# Altium schematic sheet receiver-d.SchDoc: MW Bench - Receiver
size A3; Organization: Altium Limited; Address1: L3, 12a Rodborough Rd; Address2: Frenchs Forest; Address3: NSW; Address4: Australia 2086; SheetNumber: 2; SheetTotal: 2
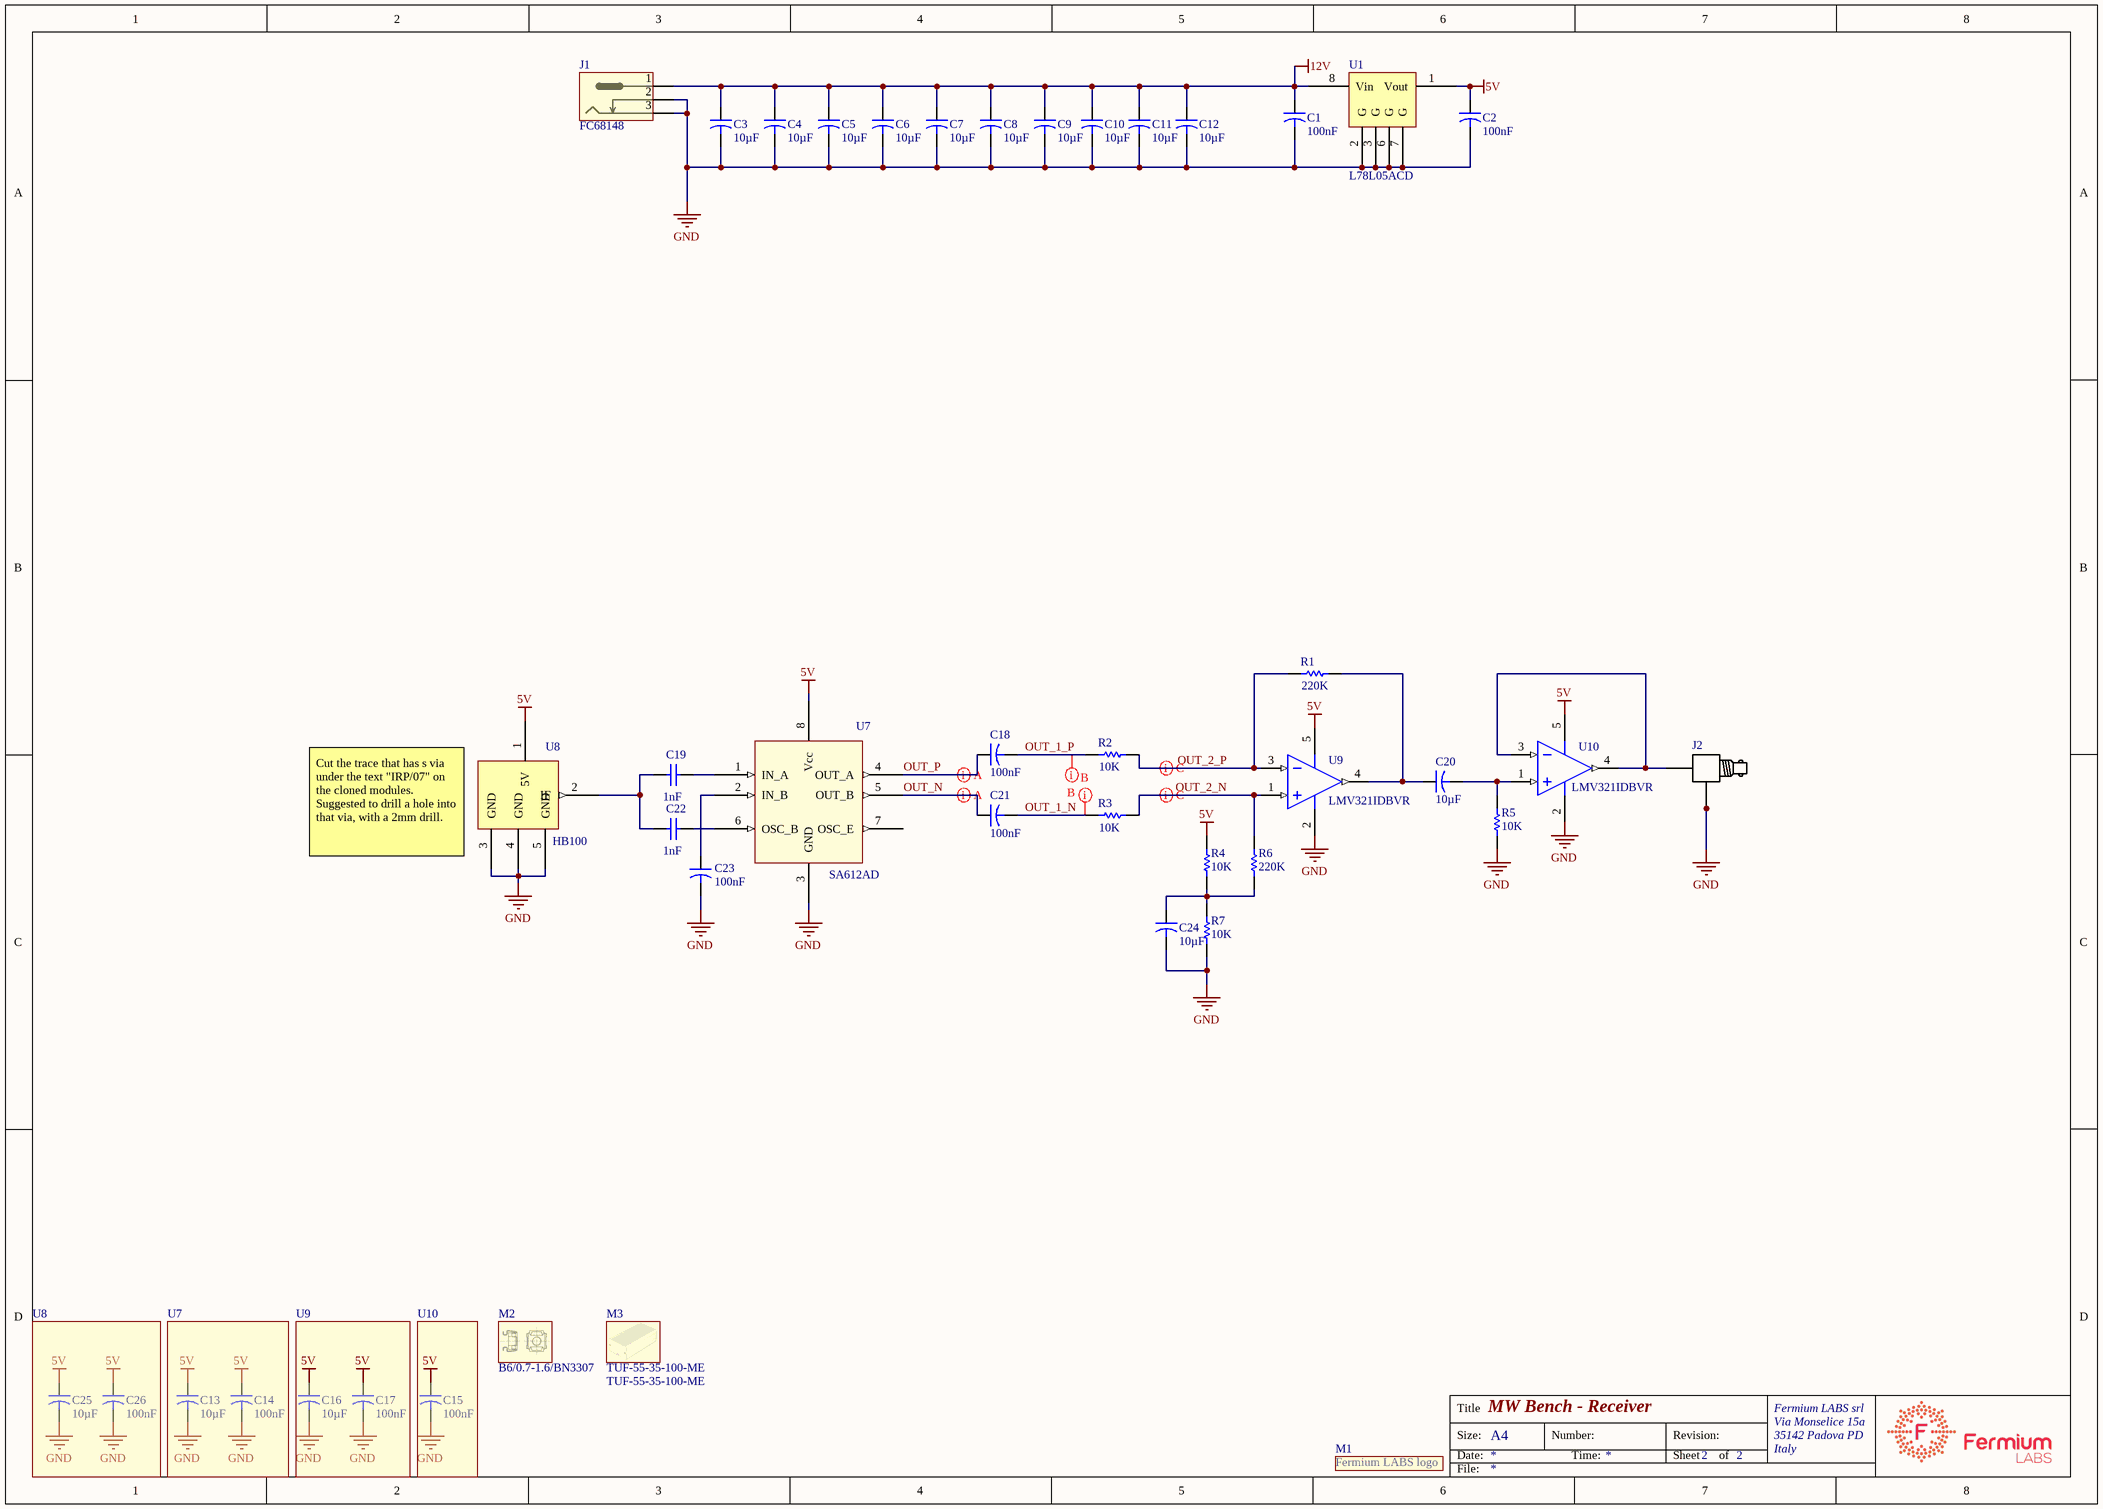
[diagram p0: receiver-d.SchDoc]

## Parts
C1  Capacitance: 100nF  [CAP 0805/2012]
C2  Capacitance: 100nF  [CAP 0805/2012]
C3  Capacitance: 10µF  [CAP 1206/3216]
C4  Capacitance: 10µF  [CAP 1206/3216]
C5  Capacitance: 10µF  [CAP 1206/3216]
C6  Capacitance: 10µF  [CAP 1206/3216]
C7  Capacitance: 10µF  [CAP 1206/3216]
C8  Capacitance: 10µF  [CAP 1206/3216]
C9  Capacitance: 10µF  [CAP 1206/3216]
C10  Capacitance: 10µF  [CAP 1206/3216]
C11  Capacitance: 10µF  [CAP 1206/3216]
C12  Capacitance: 10µF  [CAP 1206/3216]
C13  Capacitance: 10µF  [CAP 1206/3216]
C14  Capacitance: 100nF  [CAP 0805/2012]
C15  Capacitance: 100nF  [CAP 0805/2012]
C16  Capacitance: 10µF  [CAP 1206/3216]
C17  Capacitance: 100nF  [CAP 0805/2012]
C18  Capacitance: 100nF  [CAP 0805/2012]
C19  value 1nF  [CAP 0805/2012]
C20  Capacitance: 10µF  [CAP 1206/3216]
C21  Capacitance: 100nF  [CAP 0805/2012]
C22  value 1nF  [CAP 0805/2012]
C23  Capacitance: 100nF  [CAP 0805/2012]
C24  Capacitance: 10µF  [CAP 1206/3216]
C25  Capacitance: 10µF  [CAP 1206/3216]
C26  Capacitance: 100nF  [CAP 0805/2012]
J1  Supplier Part Number 1: FC68148  [dc-jack]  (no BOM)
J2  (no value)  [BNC-RA]
M1  fermiumlabs-logo  [frm-med]  (value not drawn)  (no BOM)
M2  B6/0.7-1.6/BN3307  (mechanical)
M3  TUF-55-35-100-ME
R1  value 220K  [RES 0805/2012]  (hidden comment: Res1)
R2  value 10K  [RES 0805/2012]  (hidden comment: Res1)
R3  value 10K  [RES 0805/2012]  (hidden comment: Res1)
R4  value 10K  [RES 0805/2012]  (hidden comment: Res1)
R5  value 10K  [RES 0805/2012]  (hidden comment: Res1)
R6  value 220K  [RES 0805/2012]  (hidden comment: Res1)
R7  value 10K  [RES 0805/2012]  (hidden comment: Res1)
U1  L78L05ACD  [ST SOIC-8N]
U7  Supplier Part Number 1: SA612AD  [TI SOIC-8 D]  (hidden comment: SA612A)
U8  HB100  [HB100-buried]
U9  U*  [TI SOT-23-5 DBV]  (value not drawn)
U10  U*  [TI SOT-23-5 DBV]  (value not drawn)

## Blocks framed on the sheet
U8: C25 C26
U7: C13 C14
U9: C16 C17
U10: C15

## Nets
5V: C2.1 C13.1 C14.1 C15.1 C16.1 C17.1 C25.1 C26.1 R4.2 U1.1(Vout) U7.8(Vcc) U8.1(5V) U9.5(VDD+) U10.5(VDD+)
12V: C1.1 C3.1 C4.1 C5.1 C6.1 C7.1 C8.1 C9.1 C10.1 C11.1 C12.1 J1.1 U1.8(Vin)
GND: C1.2 C2.2 C3.2 C4.2 C5.2 C6.2 C7.2 C8.2 C9.2 C10.2 C11.2 C12.2 C13.2 C14.2 C15.2 C16.2 C17.2 C23.2 C24.2 C25.2 C26.2 J1.2 J1.3 J2.2(gnd) J2.A J2.B R5.1 R7.1 U1.2(G) U1.3(G) U1.6(G) U1.7(G) U7.3(GND) U8.3(GND) U8.4(GND) U8.5(GND) U9.2(VDD-) U10.2(VDD-)
OUT_1_N: C21.2 R3.1
OUT_1_P: C18.2 R2.1
OUT_2_N: R3.2 R6.2 U9.1(IN+)
OUT_2_P: R1.1 R2.2 U9.3(IN-)
OUT_N: C21.1 U7.5(OUT_B)
OUT_P: C18.1 U7.4(OUT_A)
NetC19_1: C19.1 C22.1 U8.2(IF)
NetC19_2: C19.2 U7.1(IN_A)
NetC20_1: C20.1 R1.2 U9.4(OUT)
NetC20_2: C20.2 R5.2 U10.1(IN+)
NetC22_2: C22.2 U7.6(OSC_B)
NetC23_1: C23.1 U7.2(IN_B)
NetC24_1: C24.1 R4.1 R6.1 R7.2
NetJ2_1: J2.1 U10.3(IN-) U10.4(OUT)

Not connected (* = marked no-connect by the designer): U7 7(OSC_E)

## Layout directives
differential pair: OUT_1_N, OUT_1_P, OUT_2_N, OUT_2_P, OUT_N, OUT_P

## Notes on the sheet
- (near U8) Cut the trace that has s via under the text "IRP/07" on the cloned modules. Suggested to drill a hole into that via, with a 2mm drill.
- Title
- Size:
- Date:
- A4
- Number:
- Time:
- Revision:
- Sheet
- of
- Fermium LABS srl
- Via Monselice 15a
- 35142 Padova PD
- Italy
- File:
- (in symbol fermiumlabs-logo) Fermium LABS logo

## Library data of the parts
C1 C2 C14 C15 C17 C18 C21 C23 C26 = Cap2: Capacitor; Manufacturer: YAGEO; Manufacturer Part Number: CC0805JRX7R9BB104; Unit: pcs; SuppliedAmount: 0; MinAmount: 100; Capacitor type: ceramic; Capacitor kind: MLCC; Operating voltage: 50V; Dielectric: X7R; Tolerance: ±5%; Case - inch: 0805; Case - mm: 2012; Pads: 2 SMD; Supplier 1: TME; Supplier Part Number 1: CC0805JRX7R9104; Category: 0805 MLCC SMD Capacitors; Stock 1: 89911; Pricing 1: 100=0.00613, 300=0.00464, 1000=0.00342, 4000=0.00284, 20000=0.00273 (EUR); Weight: 0.042; Multiples: 100; Mounting: SMD; Price Type: NET; ComponentLink1URL: http://static.tme.eu/products_pics/d/b/b/dbbd93eaf25225110ca26eb66da77328/58538.jpg; ComponentLink1Description: http://static.tme.eu/products_pics/d/b/b/dbbd93eaf25225110ca26eb66da77328/58538.jpg
C3-C13 C16 C20 C24 C25 = Cap2: Capacitor; Manufacturer: SAMSUNG; Manufacturer Part Number: CL31A106KAHNNNE; Unit: pcs; SuppliedAmount: 0; MinAmount: 100; Capacitor type: ceramic; Capacitor kind: MLCC; Operating voltage: 25V; Dielectric: X5R; Tolerance: ±10%; Case - inch: 1206; Case - mm: 3216; Pads: 2 SMD; Published: 23-Sep-2002; PackageReference: CAPR5-4X5; Publisher: Altium Limited; PackageDescription: 1206; Supplier 1: TME; Supplier Part Number 1: CL31A106KAHNNNE; Category: 1206 MLCC SMD Capacitors; Stock 1: 279700; Pricing 1: 100=0.0248, 300=0.0203, 1000=0.0167, 2000=0.0131, 10000=0.0127 (EUR); Weight: 0.061; Multiples: 100; Mounting: SMD; Operating temperature: -55...85°C; Price Type: NET; ComponentLink1URL: http://static.tme.eu/products_pics/b/e/9/be9e0dd298dcf4979ea1dd3d226e0bfa/58780.jpg; ComponentLink1Description: http://static.tme.eu/products_pics/b/e/9/be9e0dd298dcf4979ea1dd3d226e0bfa/58780.jpg
C19 C22 = Cap: Capacitor; Manufacturer: Samsung; Manufacturer Part Number: CL21B102KCANNNC; Material: Ceramic; Tolerance: 10%; Dielectric: X7R; Voltage Rating: 100V; Supplier 1: TME; Supplier Part Number 1: CL21B102KCANNNC; Stock 1: 40500; Pricing 1: 100=0.0073, 300=0.0056, 1000=0.0044, 4000=0.0032, 20000=0.0031 (USD); Mount: Surface Mount; Case/Package: 0805; Case Code (Metric): 2012; Case Code (Imperial): 0805; Min Operating Temperature: -55°C; Max Operating Temperature: 125°C; Capacitance: 1nF; Package Quantity: 1; Packaging: Tape and Reel; Voltage: 100V; Voltage Rating (DC): 100V; Length: 2mm; Height: 0.65mm; Depth: 1.25mm; Width: 0.049inch; Thickness: 0.03inch; Radiation Hardening: No; Lead Free: Lead Free; ComponentLink1URL: https://datasheet.ciiva.com/26878/getdatasheetpartid-643098-26878049.pdf; ComponentLink1Description: https://datasheet.ciiva.com/26878/getdatasheetpartid-643098-26878049.pdf; ComponentLink2URL: https://datasheet.ciiva.com/29199/456063-da-01-en-vs-kondensator-0805-29199067.pdf; ComponentLink2Description: https://datasheet.ciiva.com/29199/456063-da-01-en-vs-kondensator-0805-29199067.pdf; ComponentLink3URL: https://datasheet.ciiva.com/26310/mlcc-catalogdownload2013-eng-26310183.pdf; ComponentLink3Description: https://datasheet.ciiva.com/26310/mlcc-catalogdownload2013-eng-26310183.pdf
J1 = jackdc: Manufacturer: CLIFF; Manufacturer Part Number: DC-10A FC68148; Unit: pcs; SuppliedAmount: 0; MinAmount: 1; Connector: socket; Connector type: DC supply; Contact size: 5,5/2,1mm; Plug outside diameter: 5.5mm; Plug inside diameter: 2.1mm; Connector variant: with on/off switch; Electrical mounting: soldering; Rated current: 5A; Rated voltage: 12V DC; Spatial orientation: angled 90°; Pads: 3 THT; Supplier 1: TME; Category: DC power connectors; Stock 1: 20287; Pricing 1: 1=0.4194, 20=0.3065, 100=0.2581, 500=0.2258 (USD); Weight: 1.733; Multiples: 1; Package type: in bulk; Price Type: NET; ComponentLink1URL: http://static.tme.eu/products_pics/f/8/e/f8eb2e1bea4ffe6692f5958f8ef9edd4/323250.jpg; ComponentLink1Description: http://static.tme.eu/products_pics/f/8/e/f8eb2e1bea4ffe6692f5958f8ef9edd4/323250.jpg
J2 = BNC-PCB-RA: connector bnc; Manufacturer: TE CONNECTIVITY; Manufacturer Part Number: 1-1337543-0; Unit: pcs; SuppliedAmount: 0; MinAmount: 1; Connector: socket; Connector variant: insulated; Spatial orientation: angled 90°; Wave impedance: 50Ω; Electrical mounting: THT; Mechanical mounting: on PCBs; Insulator material: polyester; Pads: 4 THT; Supplier 1: TME; Supplier Part Number 1: 1-1337543-0; Category: BNC connectors; Stock 1: 44; Pricing 1: 1=1.22, 25=1.1, 100=0.98, 1000=0.86 (EUR); Weight: 13.22; Multiples: 1; Connector type: BNC; Contact plating: gold plated; Price Type: NET; ComponentLink1URL: http://static.tme.eu/products_pics/6/3/2/63240353f8a8790dbe8f7bd93b014c1a/378606.jpg; ComponentLink1Description: http://static.tme.eu/products_pics/6/3/2/63240353f8a8790dbe8f7bd93b014c1a/378606.jpg
R1 R6 = Res1: Resistor; Manufacturer: Royal Electronic Factory; Manufacturer Part Number: 0805S8J0224T5E; Supplier 1: TME; Supplier Part Number 1: SMD0805-220K; Stock 1: 102100; Pricing 1: 100=0.0065, 1000=0.0025, 5000=0.0009, 15000=0.0008, 50000=0.0008 (USD)
R2-R5 R7 = Res1: Resistor; Manufacturer: Royal Electronic Factory; Manufacturer Part Number: 0805S8J0103T5E; Supplier 1: TME; Supplier Part Number 1: SMD0805-10K; Stock 1: 1600500; Pricing 1: 100=0.0065, 1000=0.0023, 5000=0.0008, 15000=0.0008, 50000=0.0008 (USD)
U8 = HB100: Manufacturer: China unspecified; Manufacturer Part Number: HB100; Supplier 1: Alibaba; Supplier Part Number 1: HB100
U9 U10 = LMV321IDBVR: Supplier 1: TME; Supplier Part Number 1: LMV321IDBVR
M2 = B6/0.7-1.6/BN3307: Supplier 1: TME; Supplier Part Number 1: B6/0.7-1.6/BN3307
M3 = TUF-55-35-100-ME: Supplier 1: TME; Supplier Part Number 1: TUF-55-35-100-ME
U1 = L78L05ACD: Supplier 1: TME; Supplier Part Number 1: L78L05ACD
U7 = SA612A: Supplier 1: TME; Supplier 2: Mouser; Supplier Part Number 2: 771-SA612AD01112